# Altium project MGMEZZ02.PrjPcb (part 2 of 2)

## Sheet LvlTranslate.SchDoc: Level Translators
size Letter; Author: Adam Gilbert; CompanyName: McGill University; DrawnBy: Adam Gilbert; Organization: Altium Limited; Address1: McGill Cosmology; Address2: 3600 University Street; Address3: Montreal, Quebec; Address4: Canada; Revision: Rev0; ProjectTitle: Dan DfMux Mezz; ModelNumber: MGMEZZ04; ProjectName: Dan DfMux Mezz
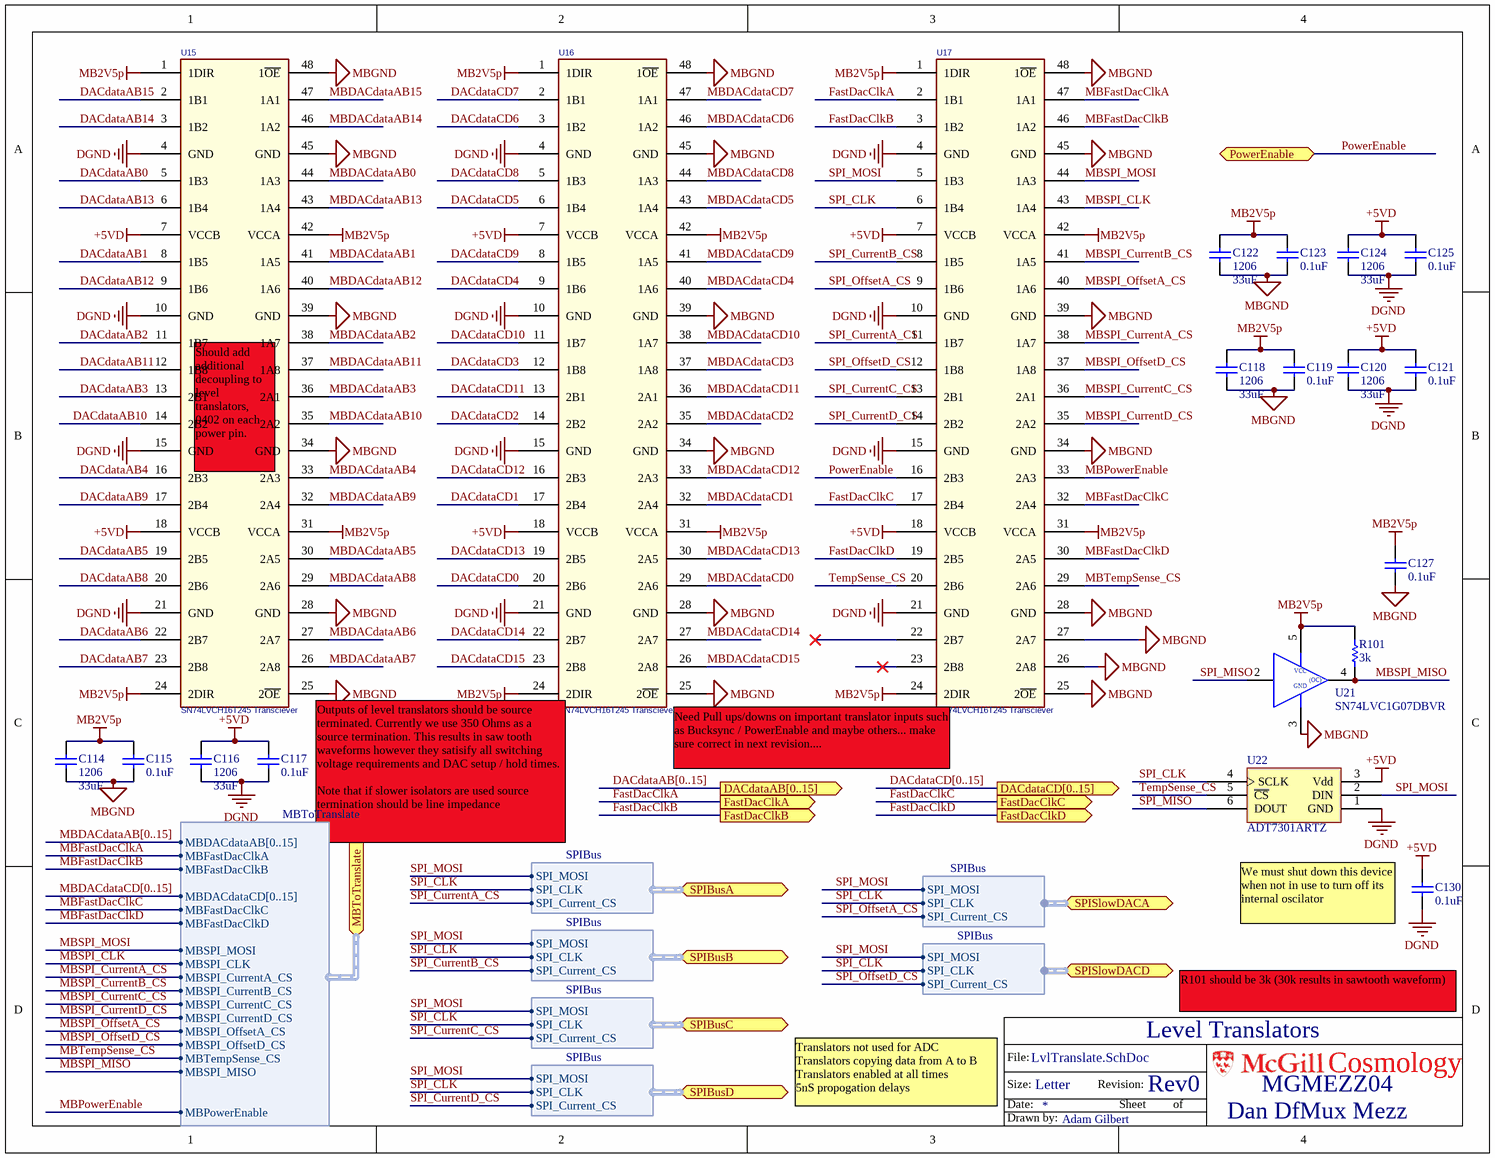
[diagram p5: LvlTranslate.SchDoc]

### Parts
C114  Footprint: 1206  [CC3225-1210]  (hidden comment: 33uF)
C115  0.1uF  [0603]
C116  Footprint: 1206  [CC3225-1210]  (hidden comment: 33uF)
C117  0.1uF  [0603]
C118  Footprint: 1206  [CC3225-1210]  (hidden comment: 33uF)
C119  0.1uF  [0603]
C120  Footprint: 1206  [CC3225-1210]  (hidden comment: 33uF)
C121  0.1uF  [0603]
C122  Footprint: 1206  [CC3225-1210]  (hidden comment: 33uF)
C123  0.1uF  [0603]
C124  Footprint: 1206  [CC3225-1210]  (hidden comment: 33uF)
C125  0.1uF  [0603]
C127  0.1uF  [0603]
C130  0.1uF  [0603]
R101  3k  [0603]
U15  SN74LVCH16T245 Transciever  [TSSOP48-0.5mmpitch]
U16  SN74LVCH16T245 Transciever  [TSSOP48-0.5mmpitch]
U17  SN74LVCH16T245 Transciever  [TSSOP48-0.5mmpitch]
U21  Manufacturers Part Number: SN74LVC1G07DBVR  [SOT23-5]  (hidden comment: 74LVC1G07)
U22  ADT7301ARTZ  [SOT23-6]

### Ports
DACdataAB[0..15] (out), DACdataCD[0..15] (out), FastDacClkA (out), FastDacClkB (out), FastDacClkC (out), FastDacClkD (out), MBToTranslate (harness MBToTranslate), PowerEnable, SPIBusA (harness SPIBus), SPIBusB (harness SPIBus), SPIBusC (harness SPIBus), SPIBusD (harness SPIBus), SPISlowDACA (harness SPIBus), SPISlowDACD (harness SPIBus)

### Harnesses
MBToTranslate: MBDACdataAB[0..15], MBFastDacClkA, MBSPI_MOSI, MBSPI_CLK, MBFastDacClkB, MBFastDacClkC, MBFastDacClkD, MBDACdataCD[0..15], MBPowerEnable, MBSPI_CurrentA_CS, MBSPI_CurrentB_CS, MBSPI_CurrentC_CS, MBSPI_CurrentD_CS, MBSPI_OffsetA_CS, MBSPI_OffsetD_CS, MBTempSense_CS, MBSPI_MISO
SPIBus: SPI_MOSI, SPI_CLK, SPI_Current_CS

### Nets
+5VD: C116.1 C117.1 C120.1 C121.1 C124.1 C125.1 C130.1 U15.7(VCCB) U15.18(VCCB) U16.7(VCCB) U16.18(VCCB) U17.7(VCCB) U17.18(VCCB) U22.3(Vdd)
DGND: C116.2 C117.2 C120.2 C121.2 C124.2 C125.2 C130.2 U15.4(GND) U15.10(GND) U15.15(GND) U15.21(GND) U16.4(GND) U16.10(GND) U16.15(GND) U16.21(GND) U17.4(GND) U17.10(GND) U17.15(GND) U17.21(GND) U22.1(GND)
MB2V5p: C114.1 C115.1 C118.1 C119.1 C122.1 C123.1 C127.1 R101.2 U15.1(1DIR) U15.24(2DIR) U15.31(VCCA) U15.42(VCCA) U16.1(1DIR) U16.24(2DIR) U16.31(VCCA) U16.42(VCCA) U17.1(1DIR) U17.24(2DIR) U17.31(VCCA) U17.42(VCCA) U21.5(Vcc)
MBGND: C114.2 C115.2 C118.2 C119.2 C122.2 C123.2 C127.2 U15.25(2~{OE}) U15.28(GND) U15.34(GND) U15.39(GND) U15.45(GND) U15.48(1~{OE}) U16.25(2~{OE}) U16.28(GND) U16.34(GND) U16.39(GND) U16.45(GND) U16.48(1~{OE}) U17.25(2~{OE}) U17.26(2A8) U17.27(2A7) U17.28(GND) U17.34(GND) U17.39(GND) U17.45(GND) U17.48(1~{OE}) U21.3(Gnd)
DACdataAB0: U15.5(1B3)
DACdataAB1: U15.8(1B5)
DACdataAB2: U15.11(1B7)
DACdataAB3: U15.13(2B1)
DACdataAB4: U15.16(2B3)
DACdataAB5: U15.19(2B5)
DACdataAB6: U15.22(2B7)
DACdataAB7: U15.23(2B8)
DACdataAB8: U15.20(2B6)
DACdataAB9: U15.17(2B4)
DACdataAB10: U15.14(2B2)
DACdataAB11: U15.12(1B8)
DACdataAB12: U15.9(1B6)
DACdataAB13: U15.6(1B4)
DACdataAB14: U15.3(1B2)
DACdataAB15: U15.2(1B1)
DACdataCD0: U16.20(2B6)
DACdataCD1: U16.17(2B4)
DACdataCD2: U16.14(2B2)
DACdataCD3: U16.12(1B8)
DACdataCD4: U16.9(1B6)
DACdataCD5: U16.6(1B4)
DACdataCD6: U16.3(1B2)
DACdataCD7: U16.2(1B1)
DACdataCD8: U16.5(1B3)
DACdataCD9: U16.8(1B5)
DACdataCD10: U16.11(1B7)
DACdataCD11: U16.13(2B1)
DACdataCD12: U16.16(2B3)
DACdataCD13: U16.19(2B5)
DACdataCD14: U16.22(2B7)
DACdataCD15: U16.23(2B8)
FastDacClkA: U17.2(1B1) ; port FastDacClkA  [project net FastDacClk]
FastDacClkB: U17.3(1B2) ; port FastDacClkB  [project net FastDacClk]
FastDacClkC: U17.17(2B4) ; port FastDacClkC  [project net FastDacClk]
FastDacClkD: U17.19(2B5) ; port FastDacClkD  [project net FastDacClk]
MBDACdataAB0: U15.44(1A3)
MBDACdataAB1: U15.41(1A5)
MBDACdataAB2: U15.38(1A7)
MBDACdataAB3: U15.36(2A1)
MBDACdataAB4: U15.33(2A3)
MBDACdataAB5: U15.30(2A5)
MBDACdataAB6: U15.27(2A7)
MBDACdataAB7: U15.26(2A8)
MBDACdataAB8: U15.29(2A6)
MBDACdataAB9: U15.32(2A4)
MBDACdataAB10: U15.35(2A2)
MBDACdataAB11: U15.37(1A8)
MBDACdataAB12: U15.40(1A6)
MBDACdataAB13: U15.43(1A4)
MBDACdataAB14: U15.46(1A2)
MBDACdataAB15: U15.47(1A1)
MBDACdataCD0: U16.29(2A6)
MBDACdataCD1: U16.32(2A4)
MBDACdataCD2: U16.35(2A2)
MBDACdataCD3: U16.37(1A8)
MBDACdataCD4: U16.40(1A6)
MBDACdataCD5: U16.43(1A4)
MBDACdataCD6: U16.46(1A2)
MBDACdataCD7: U16.47(1A1)
MBDACdataCD8: U16.44(1A3)
MBDACdataCD9: U16.41(1A5)
MBDACdataCD10: U16.38(1A7)
MBDACdataCD11: U16.36(2A1)
MBDACdataCD12: U16.33(2A3)
MBDACdataCD13: U16.30(2A5)
MBDACdataCD14: U16.27(2A7)
MBDACdataCD15: U16.26(2A8)
MBFastDacClkA: U17.47(1A1) ; port MBToTranslate.MBFastDacClkA
MBFastDacClkB: U17.46(1A2) ; port MBToTranslate.MBFastDacClkB
MBFastDacClkC: U17.32(2A4) ; port MBToTranslate.MBFastDacClkC
MBFastDacClkD: U17.30(2A5) ; port MBToTranslate.MBFastDacClkD
MBPowerEnable: U17.33(2A3) ; port MBToTranslate.MBPowerEnable
MBSPI_CLK: U17.43(1A4) ; port MBToTranslate.MBSPI_CLK
MBSPI_CurrentA_CS: U17.38(1A7) ; port MBToTranslate.MBSPI_CurrentA_CS
MBSPI_CurrentB_CS: U17.41(1A5) ; port MBToTranslate.MBSPI_CurrentB_CS
MBSPI_CurrentC_CS: U17.36(2A1) ; port MBToTranslate.MBSPI_CurrentC_CS
MBSPI_CurrentD_CS: U17.35(2A2) ; port MBToTranslate.MBSPI_CurrentD_CS
MBSPI_MISO: R101.1 U21.4(Y) ; port MBToTranslate.MBSPI_MISO
MBSPI_MOSI: U17.44(1A3) ; port MBToTranslate.MBSPI_MOSI
MBSPI_OffsetA_CS: U17.40(1A6) ; port MBToTranslate.MBSPI_OffsetA_CS
MBSPI_OffsetD_CS: U17.37(1A8) ; port MBToTranslate.MBSPI_OffsetD_CS
MBTempSense_CS: U17.29(2A6) ; port MBToTranslate.MBTempSense_CS
PowerEnable: U17.16(2B3) ; port PowerEnable
SPI_CLK: U17.6(1B4) U22.4(SCLK) ; port SPIBusA.SPI_CLK, port SPISlowDACA.SPI_CLK, port SPISlowDACD.SPI_CLK, port SPIBusB.SPI_CLK, port SPIBusC.SPI_CLK, port SPIBusD.SPI_CLK
SPI_CurrentA_CS: U17.11(1B7) ; port SPIBusA.SPI_Current_CS  [project net SPI_Current_CS]
SPI_CurrentB_CS: U17.8(1B5) ; port SPIBusB.SPI_Current_CS  [project net SPI_Current_CS]
SPI_CurrentC_CS: U17.13(2B1) ; port SPIBusC.SPI_Current_CS  [project net SPI_Current_CS]
SPI_CurrentD_CS: U17.14(2B2) ; port SPIBusD.SPI_Current_CS  [project net SPI_Current_CS]
SPI_MISO: U21.2(A) U22.6(DOUT)
SPI_MOSI: U17.5(1B3) U22.2(DIN) ; port SPIBusA.SPI_MOSI, port SPISlowDACA.SPI_MOSI, port SPISlowDACD.SPI_MOSI, port SPIBusB.SPI_MOSI, port SPIBusC.SPI_MOSI, port SPIBusD.SPI_MOSI
SPI_OffsetA_CS: U17.9(1B6) ; port SPISlowDACA.SPI_Current_CS  [project net SPI_Offset_CS]
SPI_OffsetD_CS: U17.12(1B8) ; port SPISlowDACD.SPI_Current_CS  [project net SPI_Offset_CS]
TempSense_CS: U17.20(2B6) U22.5(~{CS})

Not connected (* = marked no-connect by the designer): U17 22(2B7)* 23(2B8)*

### Buses and harness runs
bus DACdataAB[0..15] = port DACdataAB[0..15]
bus DACdataCD[0..15] = port DACdataCD[0..15]
bus MBDACdataAB[0..15]
bus MBDACdataCD[0..15]

### Notes on the sheet
- (near U15) Should add additional decoupling to level translators, 0402 on each power pin.
- Need Pull ups/downs on important translator inputs such as Bucksync / PowerEnable and maybe others... make sure correct in next revision....
- (near U16) Outputs of level translators should be source terminated. Currently we use 350 Ohms as a source termination. This results in saw tooth waveforms however they satisify all switching voltage requirements and DAC setup / hold times.
  Note that if slower isolators are used source termination should be line impedance
- (near C130) We must shut down this device when not in use to turn off its internal oscilator
- R101 should be 3k (30k results in sawtooth waveform)
- Translators not used for ADC
  Translators copying data from A to B
  Translators enabled at all times
  5nS propogation delays
- File:
- Size:
- Date:
- Letter
- Revision:
- Sheet
- of
- Cosmology
- Drawn by:
- (in symbol 74LVC1G07) VCC; (OC); GND

### Library data of the parts
C114 C116 C118 C120 C122 C124 = CAP 1210: Capacitor, Ceramic, 1210; Manufacturer: TDK Corporation; Part Constraints: 33uF or 47uF  (1206 or 1210) 25V X5R; Manufacturers Part Number: C3216X5R1E336M; Assembly Comments: none; Type: Capacitor; SupplierUnitCost: $1.1; Value: 33uF; Supplier 1: Digi-Key; Supplier Part Number 1: 445-8046-1-ND
C115 C117 C119 C121 C123 C125 C127 C130 = CAP 0603: Capacitor, Ceramic, 0603; Part Constraints: 10% 16V X7R 0603; Manufacturer: Generic; Manufacturers Part Number: Generic; Value: 0.1uF; Type: Capacitor; SupplierUnitCost: 0
R101 = RES 0603: Resistor; Manufacturer: Generic; Part Constraints: 1% 1/10W 100ppm 0603; Assembly Comments: none; Manufacturers Part Number: Generic; Type: Resistor; SupplierUnitCost: 0; Value: 3k
U15-U17 = SN74LVCH16T245 Transciever: Manufacturer: Texas Instruments; Assembly Comments: none; Part Constraints: SN74LVCH16T245; Manufacturers Part Number: SN74LVCH16T245; Type: IC; Supplier 1: Digi-Key; Supplier Part Number 1: 296-27606-6-ND
U21 = 74LVC1G07: Single  NON-INVERTING BUFFER, Open Drain; Manufacturer: Texas Instruments; Assembly Comments: none; Part Constraints: SN74LVC1G07DBVR; SupplierUnitCost: $0.09; Type: IC; Supplier 1: Digi-Key; Supplier Part Number 1: 296-8485-1-ND
U22 = ADT7301: Digital Temperature Sensor, 13-Bit, +/-1 Degree Accurate; Manufacturer: Analog Devices; CanPurchaseFrom: Digikey; Footprint: *; TechInfo: *; Manufacturers Part Number: ADT7301ARTZ; Part constraints: ADT7301ARTZ

## Sheet SlowDAC.SchDoc: Slow DAC
size Letter
Used 2 times, as channels AF, DF. Parts and nets are listed once, with the designators drawn on the sheet.
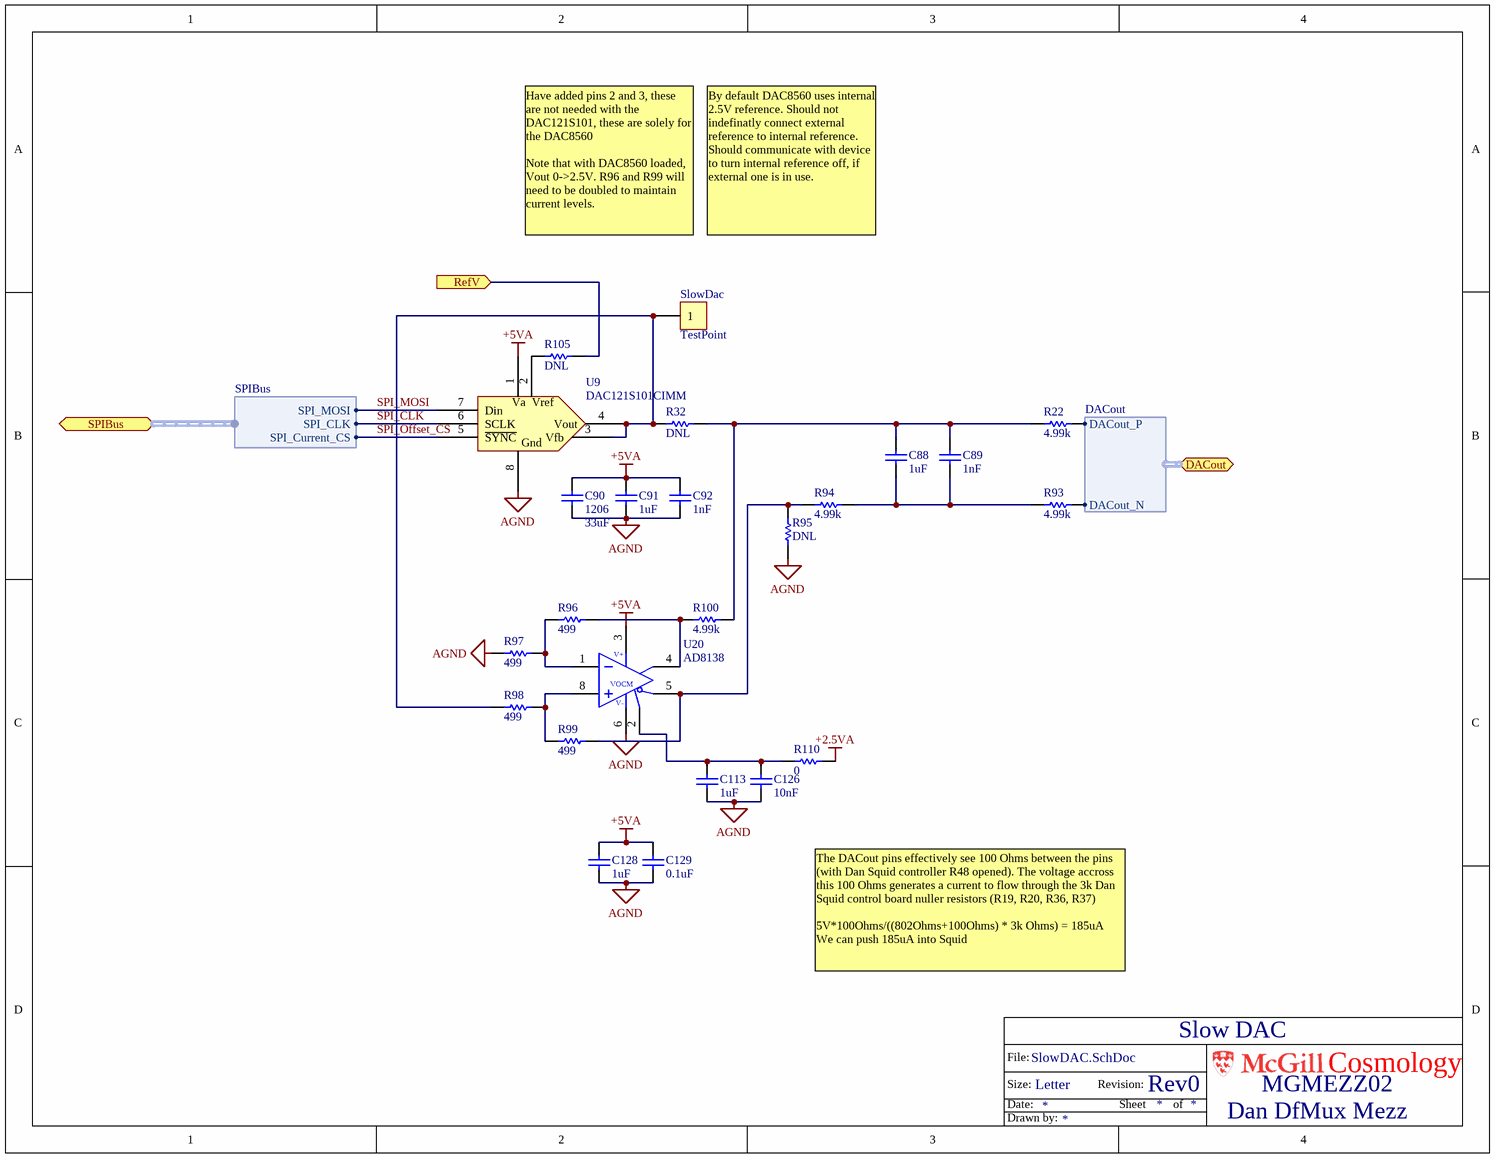
[diagram p6: SlowDAC.SchDoc]

### Parts
C88  1uF  [0603]
C89  1nF  [0603]
C90  Footprint: 1206  [CC3225-1210]  (hidden comment: 33uF)
C91  1uF  [0603]
C92  1nF  [0603]
C113  1uF  [0603]
C126  10nF  [0603]
C128  1uF  [0603]
C129  0.1uF  [0603]
R22  4.99k  [0603]
R32  DNL  [0603]
R93  4.99k  [0603]
R94  4.99k  [0603]
R95  DNL  [0603]
R96  499  [0603]
R97  499  [0603]
R98  499  [0603]
R99  499  [0603]
R100  4.99k  [0603]
R105  DNL  [0603]
R110  0  [0603]
SlowDac  TestPoint  [TP-3520-SK]  (no BOM)
U9  DAC121S101CIMM  [MSOP-8]
U20  AD8138  [SO8]

### Ports
DACout (harness DACout), RefV (in), SPIBus (harness SPIBus)

### Harnesses
DACout: DACout_N, DACout_P
SPIBus: SPI_MOSI, SPI_CLK, SPI_Current_CS

### Nets
+2.5VA: R110.1
+5VA: C90.2 C91.2 C92.2 C128.2 C129.1 U9.1(Va) U20.3(V+)
AGND: C90.1 C91.1 C92.1 C113.1 C126.1 C128.1 C129.2 R95.2 R97.2 U9.8(Gnd) U20.6(V-)
RefV: R105.2 ; port RefV
SPI_CLK: U9.6(SCLK) ; port SPIBus.SPI_CLK
SPI_MOSI: U9.7(Din) ; port SPIBus.SPI_MOSI
SPI_Offset_CS: U9.5(~{SYNC}) ; port SPIBus.SPI_Current_CS
NetC88_1: C88.1 C89.1 R93.2 R94.1
NetC88_2: C88.2 C89.2 R22.2 R32.1 R100.1
NetC113_2: C113.2 C126.2 R110.2 U20.2(VOCM)
NetR22_1: R22.1 ; port DACout.DACout_P
NetR32_2: R32.2 R98.2 SlowDac.1 U9.3(NC) U9.4(Vout)
NetR93_1: R93.1 ; port DACout.DACout_N
NetR94_2: R94.2 R95.1 R99.1 U20.5(OUT-)
NetR96_1: R96.1 R100.2 U20.4(OUT+)
NetR96_2: R96.2 R97.1 U20.1(IN-)
NetR98_1: R98.1 R99.2 U20.8(IN+)
NetR105_1: R105.1 U9.2(NC)

Not connected (* = marked no-connect by the designer): U20 7(NC)

### Channels
AF: designators end in AF; ports RefV=RefVolt
DF: designators end in DF; ports RefV=RefVolt

### Notes on the sheet
- Have added pins 2 and 3, these are not needed with the DAC121S101, these are solely for the DAC8560
  Note that with DAC8560 loaded, Vout 0->2.5V. R96 and R99 will need to be doubled to maintain current levels.
- By default DAC8560 uses internal 2.5V reference. Should not indefinatly connect external reference to internal reference. Should communicate with device to turn internal reference off, if external one is in use.
- The DACout pins effectively see 100 Ohms between the pins (with Dan Squid controller R48 opened). The voltage accross this 100 Ohms generates a current to flow through the 3k Dan Squid control board nuller resistors (R19, R20, R36, R37)
  5V*100Ohms/((802Ohms+100Ohms) * 3k Ohms) = 185uA
  We can push 185uA into Squid
- File:
- Size:
- Date:
- Letter
- Revision:
- Sheet
- of
- Cosmology
- Drawn by:

### Library data of the parts
C88 C91 = CAP 0603: Capacitor, Ceramic, 0603; Part Constraints: 10% 16V X7R 0603; Manufacturer: Generic; Manufacturers Part Number: e.g C1608X7R1C105K; Value: 1uF; Type: Capacitor; SupplierUnitCost: $0.12
C89 C92 C129 = CAP 0603: as C115 on sheet LvlTranslate; Manufacturers Part Number: Generic; Type: Capacitor; SupplierUnitCost: 0
  C89 C92: Value: 1nF
  C129: Value: 0.1uF
C90 = CAP 1210: as C114 on sheet LvlTranslate; Type: Capacitor; SupplierUnitCost: $1.1; Value: 33uF; Supplier 1: Digi-Key; Supplier Part Number 1: 445-8046-1-ND
C113 C128 = CAP 0603: Capacitor, Ceramic, 0603; Part Constraints: 10% 16V X7R 0603; Manufacturer: Generic; Manufacturers Part Number: e.g C1608X7R1C105K; Assembly Comments: none; Value: 1uF; Type: Capacitor; SupplierUnitCost: $0.12
C126 = CAP 0603: Capacitor, Ceramic, 0603; Part Constraints: 10% 16V X7R 0603; Manufacturer: Generic; Assembly Comments: none; Manufacturers Part Number: Generic; Value: 10nF; Type: Capacitor; SupplierUnitCost: 0
R22 R32 R93-R100 R105 R110 = RES 0603: as R1 on sheet ADC; Manufacturers Part Number: Generic; Type: Resistor; SupplierUnitCost: 0
  R22 R93 R94 R100: Value: 4.99k
  R32 R95 R105: Value: DNL
  R96-R99: Value: 499
  R110: Value: 0
SlowDac = TestPoint: TestPoint1; Assembly Comments: none; Footprint: *; Type: Test Point; SupplierUnitCost: 0
U9 = DAC121S101CIMM/NOPB: CONV D/A 12BIT MICROPWR 8MSOP; Manufacturer: National Semiconductor; Settling Time: 12µs; Number of Bits: 12; Data Interface: DSP, MICROWIRE™, QSPI™, Serial, SPI™; Number of Converters: 1; Voltage Supply Source: Single Supply; Power Dissipation (Max): 1.72mW; Number of Outputs and Type: 1 Voltage, Unipolar; 1 Voltage, Bipolar; Assembly Comments: none; RoHS: RoHS Compliant; Category: Integrated Circuits (ICs); Stock 1: 3011; Pricing 1: 1=3.5, 25=2.8616, 100=2.5698, 250=2.33624, 500=2.0442 (CAD); Operating Temperature: -40°C ~ 105°C; Mounting Type: Surface Mount; Package / Case: 8-TSSOP, 8-MSOP (0.118", 3.00mm Width); Supplier Device Package: 8-MSOP; Packaging: Cut Tape (CT); Sampling Rate (Per Second): *; ComponentLink1URL: http://www.ti.com/lit/ds/symlink/dac121s101.pdf; ComponentLink1Description: http://www.ti.com/lit/ds/symlink/dac121s101.pdf; Supplier 1: Digi-Key; Supplier Part Number 1: DAC121S101CIMMCT-ND; Part Constraints: DAC121S101CIMM/NOPB; Manufacturers Part Number: DAC121S101CIMM/NOPB; Type: IC; SupplierUnitCost: $3.70
U20 = AD8138: IC AMP DIFF LDIST LP 95MA 8SOIC; Manufacturer: Analog Devices Inc; Manufacturers Part Number: AD8138ARZ; Assembly Comments: none; Supplier 1: Digi-Key; RoHS: RoHS Compliant; Category: Integrated Circuits (ICs); Type: IC; Applications: Data Acquisition; Mounting Type: Surface Mount; Package / Case: 8-SOIC (0.154", 3.90mm Width); Supplier Device Package: 8-SOIC; Packaging: Tube; ComponentLink1URL: http://www.analog.com/static/imported-files/data_sheets/AD8138.pdf; ComponentLink1Description: http://www.analog.com/static/imported-files/data_sheets/AD8138.pdf; Part Constraints: AD8138ARZ; SupplierUnitCost: $6.44

## Sheet FMCLPCConnector.SchDoc: FMC Connector
size Letter; ProjectTitle: Dan DfMux Mezz; ModelNumber: MGMEZZ04
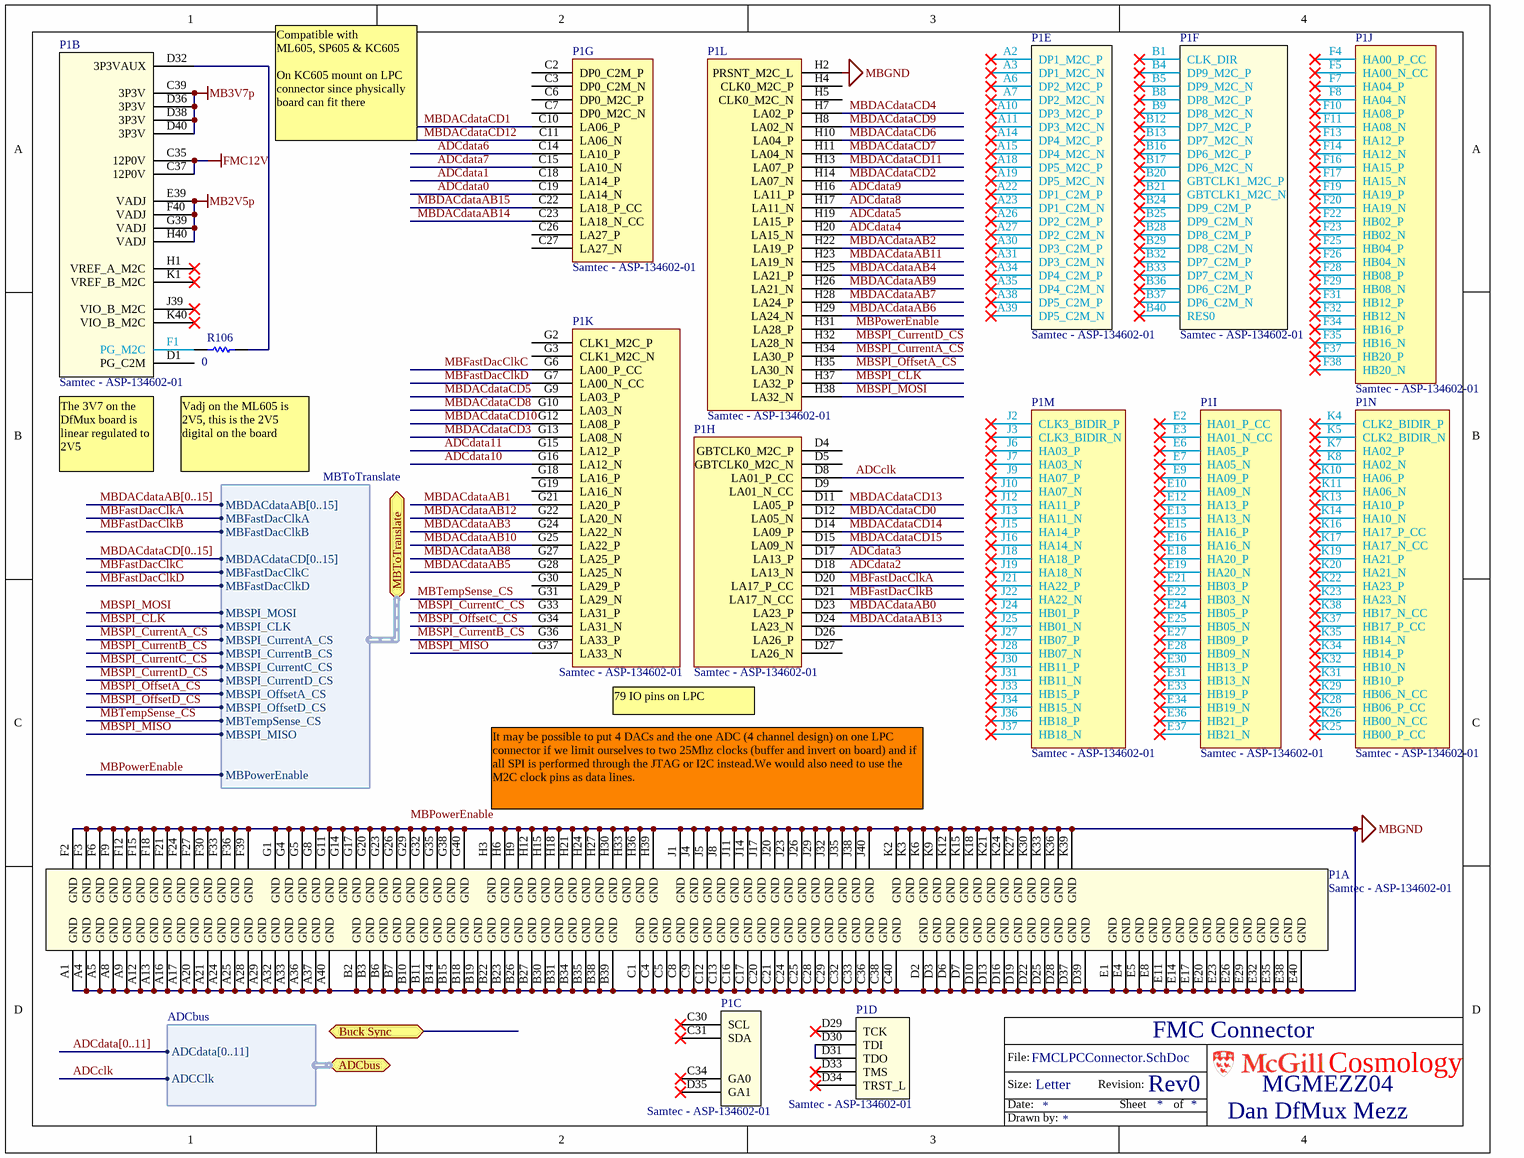
[diagram p7: FMCLPCConnector.SchDoc]

### Parts
P1  Samtec - ASP-134602-01  [BTB-SM1-27-2V400M]  (parts A,B,C,D,E,F,G,H,I,J,K,L,M,N of 14)
R106  0  [0603]

### Ports
ADCbus (harness ADCbus), Buck Sync, MBToTranslate (harness MBToTranslate)

### Harnesses
ADCbus: ADCdata[0..11], ADCClk
MBToTranslate: MBDACdataAB[0..15], MBFastDacClkA, MBSPI_MOSI, MBSPI_CLK, MBFastDacClkB, MBFastDacClkC, MBFastDacClkD, MBDACdataCD[0..15], MBPowerEnable, MBSPI_CurrentA_CS, MBSPI_CurrentB_CS, MBSPI_CurrentC_CS, MBSPI_CurrentD_CS, MBSPI_OffsetA_CS, MBSPI_OffsetD_CS, MBTempSense_CS, MBSPI_MISO

### Nets
FMC12V: P1.C35(12P0V) P1.C37(12P0V)
MB2V5p: P1.E39(VADJ) P1.F40(VADJ) P1.G39(VADJ) P1.H40(VADJ)
MB3V7p: P1.C39(3P3V) P1.D36(3P3V) P1.D38(3P3V) P1.D40(3P3V)
MBGND: P1.A1(GND) P1.A4(GND) P1.A5(GND) P1.A8(GND) P1.A9(GND) P1.A12(GND) P1.A13(GND) P1.A16(GND) P1.A17(GND) P1.A20(GND) P1.A21(GND) P1.A24(GND) P1.A25(GND) P1.A28(GND) P1.A29(GND) P1.A32(GND) P1.A33(GND) P1.A36(GND) P1.A37(GND) P1.A40(GND) P1.B2(GND) P1.B3(GND) P1.B6(GND) P1.B7(GND) P1.B10(GND) P1.B11(GND) P1.B14(GND) P1.B15(GND) P1.B18(GND) P1.B19(GND) P1.B22(GND) P1.B23(GND) P1.B26(GND) P1.B27(GND) P1.B30(GND) P1.B31(GND) P1.B34(GND) P1.B35(GND) P1.B38(GND) P1.B39(GND) P1.C1(GND) P1.C4(GND) P1.C5(GND) P1.C8(GND) P1.C9(GND) P1.C12(GND) P1.C13(GND) P1.C16(GND) P1.C17(GND) P1.C20(GND) P1.C21(GND) P1.C24(GND) P1.C25(GND) P1.C28(GND) P1.C29(GND) P1.C32(GND) P1.C33(GND) P1.C36(GND) P1.C38(GND) P1.C40(GND) P1.D2(GND) P1.D3(GND) P1.D6(GND) P1.D7(GND) P1.D10(GND) P1.D13(GND) P1.D16(GND) P1.D19(GND) P1.D22(GND) P1.D25(GND) P1.D28(GND) P1.D37(GND) P1.D39(GND) P1.E1(GND) P1.E4(GND) P1.E5(GND) P1.E8(GND) P1.E11(GND) P1.E14(GND) P1.E17(GND) P1.E20(GND) P1.E23(GND) P1.E26(GND) P1.E29(GND) P1.E32(GND) P1.E35(GND) P1.E38(GND) P1.E40(GND) P1.F2(GND) P1.F3(GND) P1.F6(GND) P1.F9(GND) P1.F12(GND) P1.F15(GND) P1.F18(GND) P1.F21(GND) P1.F24(GND) P1.F27(GND) P1.F30(GND) P1.F33(GND) P1.F36(GND) P1.F39(GND) P1.G1(GND) P1.G4(GND) P1.G5(GND) P1.G8(GND) P1.G11(GND) P1.G14(GND) P1.G17(GND) P1.G20(GND) P1.G23(GND) P1.G26(GND) P1.G29(GND) P1.G32(GND) P1.G35(GND) P1.G38(GND) P1.G40(GND) P1.H2(PRSNT_M2C_L) P1.H3(GND) P1.H6(GND) P1.H9(GND) P1.H12(GND) P1.H15(GND) P1.H18(GND) P1.H21(GND) P1.H24(GND) P1.H27(GND) P1.H30(GND) P1.H33(GND) P1.H36(GND) P1.H39(GND) P1.J1(GND) P1.J4(GND) P1.J5(GND) P1.J8(GND) P1.J11(GND) P1.J14(GND) P1.J17(GND) P1.J20(GND) P1.J23(GND) P1.J26(GND) P1.J29(GND) P1.J32(GND) P1.J35(GND) P1.J38(GND) P1.J40(GND) P1.K2(GND) P1.K3(GND) P1.K6(GND) P1.K9(GND) P1.K12(GND) P1.K15(GND) P1.K18(GND) P1.K21(GND) P1.K24(GND) P1.K27(GND) P1.K30(GND) P1.K33(GND) P1.K36(GND) P1.K39(GND)
ADCclk: P1.D8(LA01_P_CC) ; port ADCbus.ADCClk
ADCdata0: P1.C19(LA14_N)
ADCdata1: P1.C18(LA14_P)
ADCdata2: P1.D18(LA13_N)
ADCdata3: P1.D17(LA13_P)
ADCdata4: P1.H20(LA15_N)
ADCdata5: P1.H19(LA15_P)
ADCdata6: P1.C14(LA10_P)
ADCdata7: P1.C15(LA10_N)
ADCdata8: P1.H17(LA11_N)
ADCdata9: P1.H16(LA11_P)
ADCdata10: P1.G16(LA12_N)
ADCdata11: P1.G15(LA12_P)
MBDACdataAB0: P1.D23(LA23_P)
MBDACdataAB1: P1.G21(LA20_P)
MBDACdataAB2: P1.H22(LA19_P)
MBDACdataAB3: P1.G24(LA22_N)
MBDACdataAB4: P1.H25(LA21_P)
MBDACdataAB5: P1.G28(LA25_N)
MBDACdataAB6: P1.H29(LA24_N)
MBDACdataAB7: P1.H28(LA24_P)
MBDACdataAB8: P1.G27(LA25_P)
MBDACdataAB9: P1.H26(LA21_N)
MBDACdataAB10: P1.G25(LA22_P)
MBDACdataAB11: P1.H23(LA19_N)
MBDACdataAB12: P1.G22(LA20_N)
MBDACdataAB13: P1.D24(LA23_N)
MBDACdataAB14: P1.C23(LA18_N_CC)
MBDACdataAB15: P1.C22(LA18_P_CC)
MBDACdataCD0: P1.D12(LA05_N)
MBDACdataCD1: P1.C10(LA06_P)
MBDACdataCD2: P1.H14(LA07_N)
MBDACdataCD3: P1.G13(LA08_N)
MBDACdataCD4: P1.H7(LA02_P)
MBDACdataCD5: P1.G9(LA03_P)
MBDACdataCD6: P1.H10(LA04_P)
MBDACdataCD7: P1.H11(LA04_N)
MBDACdataCD8: P1.G10(LA03_N)
MBDACdataCD9: P1.H8(LA02_N)
MBDACdataCD10: P1.G12(LA08_P)
MBDACdataCD11: P1.H13(LA07_P)
MBDACdataCD12: P1.C11(LA06_N)
MBDACdataCD13: P1.D11(LA05_P)
MBDACdataCD14: P1.D14(LA09_P)
MBDACdataCD15: P1.D15(LA09_N)
MBFastDacClkA: P1.D20(LA17_P_CC) ; port MBToTranslate.MBFastDacClkA
MBFastDacClkB: P1.D21(LA17_N_CC) ; port MBToTranslate.MBFastDacClkB
MBFastDacClkC: P1.G6(LA00_P_CC) ; port MBToTranslate.MBFastDacClkC
MBFastDacClkD: P1.G7(LA00_N_CC) ; port MBToTranslate.MBFastDacClkD
MBPowerEnable: P1.H31(LA28_P) ; port MBToTranslate.MBPowerEnable
MBSPI_CLK: P1.H37(LA32_P) ; port MBToTranslate.MBSPI_CLK
MBSPI_CurrentA_CS: P1.H34(LA30_P) ; port MBToTranslate.MBSPI_CurrentA_CS
MBSPI_CurrentB_CS: P1.G36(LA33_P) ; port MBToTranslate.MBSPI_CurrentB_CS
MBSPI_CurrentC_CS: P1.G33(LA31_P) ; port MBToTranslate.MBSPI_CurrentC_CS
MBSPI_CurrentD_CS: P1.H32(LA28_N) ; port MBToTranslate.MBSPI_CurrentD_CS
MBSPI_MISO: P1.G37(LA33_N) ; port MBToTranslate.MBSPI_MISO
MBSPI_MOSI: P1.H38(LA32_N) ; port MBToTranslate.MBSPI_MOSI
MBSPI_OffsetA_CS: P1.H35(LA30_N) ; port MBToTranslate.MBSPI_OffsetA_CS
MBSPI_OffsetC_CS: P1.G34(LA31_N)
MBTempSense_CS: P1.G31(LA29_N) ; port MBToTranslate.MBTempSense_CS
NetP1_D30: P1.D30(TDI) P1.D31(TDO)
NetP1_D32: P1.D32(3P3VAUX) R106.1
NetP1_F1: P1.F1(PG_M2C) R106.2

Not connected (* = marked no-connect by the designer): P1 A2(DP1_M2C_P)* A3(DP1_M2C_N)* A6(DP2_M2C_P)* A7(DP2_M2C_N)* A10(DP3_M2C_P)* A11(DP3_M2C_N)* A14(DP4_M2C_P)* A15(DP4_M2C_N)* A18(DP5_M2C_P)* A19(DP5_M2C_N)* A22(DP1_C2M_P)* A23(DP1_C2M_N)* A26(DP2_C2M_P)* A27(DP2_C2M_N)* A30(DP3_C2M_P)* A31(DP3_C2M_N)* A34(DP4_C2M_P)* A35(DP4_C2M_N)* A38(DP5_C2M_P)* A39(DP5_C2M_N)* B1(CLK_DIR)* B4(DP9_M2C_P)* B5(DP9_M2C_N)* B8(DP8_M2C_P)* B9(DP8_M2C_N)* B12(DP7_M2C_P)* B13(DP7_M2C_N)* B16(DP6_M2C_P)* B17(DP6_M2C_N)* B20(GBTCLK1_M2C_P)* B21(GBTCLK1_M2C_N)* B24(DP9_C2M_P)* B25(DP9_C2M_N)* B28(DP8_C2M_P)* B29(DP8_C2M_N)* B32(DP7_C2M_P)* B33(DP7_C2M_N)* B36(DP6_C2M_P)* B37(DP6_C2M_N)* B40(RES0)* C2(DP0_C2M_P) C3(DP0_C2M_N) C6(DP0_M2C_P) C7(DP0_M2C_N) C26(LA27_P) C27(LA27_N) C30(SCL)* C31(SDA)* C34(GA0)* D1(PG_C2M) D4(GBTCLK0_M2C_P) D5(GBTCLK0_M2C_N) D9(LA01_N_CC) D26(LA26_P) D27(LA26_N) D29(TCK)* D33(TMS)* D34(TRST_L)* D35(GA1)* E2(HA01_P_CC)* E3(HA01_N_CC)* E6(HA05_P)* E7(HA05_N)* E9(HA09_P)* E10(HA09_N)* E12(HA13_P)* E13(HA13_N)* E15(HA16_P)* E16(HA16_N)* E18(HA20_P)* E19(HA20_N)* E21(HB03_P)* E22(HB03_N)* E24(HB05_P)* E25(HB05_N)* E27(HB09_P)* E28(HB09_N)* E30(HB13_P)* E31(HB13_N)* E33(HB19_P)* E34(HB19_N)* E36(HB21_P)* E37(HB21_N)* F4(HA00_P_CC)* F5(HA00_N_CC)* F7(HA04_P)* F8(HA04_N)* F10(HA08_P)* F11(HA08_N)* F13(HA12_P)* F14(HA12_N)* F16(HA15_P)* F17(HA15_N)* F19(HA19_P)* F20(HA19_N)* F22(HB02_P)* F23(HB02_N)* F25(HB04_P)* F26(HB04_N)* F28(HB08_P)* F29(HB08_N)* F31(HB12_P)* F32(HB12_N)* F34(HB16_P)* F35(HB16_N)* F37(HB20_P)* F38(HB20_N)* G2(CLK1_M2C_P) G3(CLK1_M2C_N) G18(LA16_P) G19(LA16_N) G30(LA29_P) H1(VREF_A_M2C)* H4(CLK0_M2C_P) H5(CLK0_M2C_N) J2(CLK3_BIDIR_P)* J3(CLK3_BIDIR_N)* J6(HA03_P)* J7(HA03_N)* J9(HA07_P)* J10(HA07_N)* J12(HA11_P)* J13(HA11_N)* J15(HA14_P)* J16(HA14_N)* J18(HA18_P)* J19(HA18_N)* J21(HA22_P)* J22(HA22_N)* J24(HB01_P)* J25(HB01_N)* J27(HB07_P)* J28(HB07_N)* J30(HB11_P)* J31(HB11_N)* J33(HB15_P)* J34(HB15_N)* J36(HB18_P)* J37(HB18_N)* J39(VIO_B_M2C)* K1(VREF_B_M2C)* K4(CLK2_BIDIR_P)* K5(CLK2_BIDIR_N)* K7(HA02_P)* K8(HA02_N)* K10(HA06_P)* K11(HA06_N)* K13(HA10_P)* K14(HA10_N)* K16(HA17_P_CC)* K17(HA17_N_CC)* K19(HA21_P)* K20(HA21_N)* K22(HA23_P)* K23(HA23_N)* K25(HB00_P_CC)* K26(HB00_N_CC)* K28(HB06_P_CC)* K29(HB06_N_CC)* K31(HB10_P)* K32(HB10_N)* K34(HB14_P)* K35(HB14_N)* K37(HB17_P_CC)* K38(HB17_N_CC)* K40(VIO_B_M2C)*

### Buses and harness runs
bus ADCdata[0..11]
bus MBDACdataAB[0..15]
bus MBDACdataCD[0..15]

### Notes on the sheet
- Compatible with
  ML605, SP605 & KC605
  On KC605 mount on LPC connector since physically board can fit there
- (near P1) The 3V7 on the DfMux board is linear regulated to 2V5
- Vadj on the ML605 is 2V5, this is the 2V5 digital on the board
- (near P1) 79 IO pins on LPC
- It may be possible to put 4 DACs and the one ADC (4 channel design) on one LPC connector if we limit ourselves to two 25Mhz clocks (buffer and invert on board) and if all SPI is performed through the JTAG or I2C instead.We would also need to use the M2C clock pins as data lines.
- Labels drawn without touching a wire or pin: MBPowerEnable
- File:
- Size:
- Date:
- Letter
- Revision:
- Sheet
- of
- Cosmology
- Drawn by:

### Library data of the parts
P1 = Samtec - ASP-134602-01: Samtec ASP-134602-01
R106 = RES 0603: Resistor; Manufacturer: Generic; Part Constraints: 1% 1/10W 100ppm 0603; Manufacturers Part Number: Generic; Value: 0; Type: Resistor; SupplierUnitCost: 0

## Nets that join several sheets
+2.5VA: ADC (14 pins), Power (5 pins), AF (R110AF.1), DF (R110DF.1)
+2.5VD: ADC (8 pins), Power (+2.5VD.1 C108.1 L13.1 R71.2)
+5VA: ADC (8 pins), Power (5 pins), A (12 pins), AF (7 pins), DF (7 pins), B (12 pins), C (12 pins), D (12 pins)
+5VD: Power (5 pins), LvlTranslate (14 pins)
-5VA: ADC (8 pins), Power (-5VA.1 C102.2 R39.1 U13.3), A (7 pins), B (7 pins), C (7 pins), D (7 pins)
AGND: MGMEZZ02 (25 pins), ADC (42 pins), Power (14 pins), A (36 pins), AF (11 pins), DF (11 pins), B (36 pins), C (36 pins), D (36 pins)
DGND: MGMEZZ02 (J7.1), ADC (9 pins), Power (8 pins), A (R108A.1 U5A.15), LvlTranslate (20 pins), B (R108B.1 U5B.15), C (R108C.1 U5C.15), D (R108D.1 U5D.15)
FMC12V: Power (10 pins), FMCLPCConnector (P1.C35 P1.C37)
MB2V5p: ADC (8 pins), Power (C107.1 DP2.1 R46.1), Connector (J1.1 J1.2 J3.1 J3.2), LvlTranslate (21 pins), FMCLPCConnector (P1.E39 P1.F40 P1.G39 P1.H40)
MB3V7p: Power (C104.1 Ip3V7p.1 R45.1), Connector (J1.79 J1.80 J1.81 J1.82), FMCLPCConnector (P1.C39 P1.D36 P1.D38 P1.D40)
MB5V5n: Power (R79.1), Connector (J1.83 J1.84)
MB5V5p: Power (R78.1), Connector (J1.77 J1.78)
MBGND: MGMEZZ02 (J5.1), ADC (7 pins), Power (26 pins), Connector (12 pins), LvlTranslate (28 pins), FMCLPCConnector (160 pins)
ADCA_N: MGMEZZ02 (J2.11), ADC (R3.2 R4.2)
ADCA_P: MGMEZZ02 (J2.3), ADC (R4.1 R6.2)
ADCB_N: MGMEZZ02 (J2.13), ADC (R11.2 R12.2)
ADCB_P: MGMEZZ02 (J2.6), ADC (R12.1 R15.2)
ADCclk: ADC (R47.1 R107.2 U2.20), Connector (J1.19), FMCLPCConnector (P1.D8)
ADCdata0: ADC (U2.38), Connector (J1.3), FMCLPCConnector (P1.C19)
ADCdata1: ADC (U2.37), Connector (J1.4), FMCLPCConnector (P1.C18)
ADCdata2: ADC (U2.36), Connector (J1.5), FMCLPCConnector (P1.D18)
ADCdata3: ADC (U2.35), Connector (J1.6), FMCLPCConnector (P1.D17)
ADCdata4: ADC (U2.34), Connector (J1.7), FMCLPCConnector (P1.H20)
ADCdata5: ADC (U2.33), Connector (J1.8), FMCLPCConnector (P1.H19)
ADCdata6: ADC (U2.32), Connector (J1.9), FMCLPCConnector (P1.C14)
ADCdata7: ADC (U2.31), Connector (J1.10), FMCLPCConnector (P1.C15)
ADCdata8: ADC (U2.30), Connector (J1.11), FMCLPCConnector (P1.H17)
ADCdata9: ADC (U2.29), Connector (J1.12), FMCLPCConnector (P1.H16)
ADCdata10: ADC (U2.28), Connector (J1.13), FMCLPCConnector (P1.G16)
ADCdata11: ADC (U2.27), Connector (J1.14), FMCLPCConnector (P1.G15)
BuckSync: Power (BuckSync.1 U10.17 U18.4), Connector (J3.50)
DACA_N: MGMEZZ02 (J2.9), A (C112A.2 L19A.2), AF (R93AF.1)
DACA_P: MGMEZZ02 (J2.1), A (C112A.1 L18A.2), AF (R22AF.1)
DACB_N: MGMEZZ02 (J2.10), B (C112B.2 L19B.2)
DACB_P: MGMEZZ02 (J2.2), B (C112B.1 L18B.2)
DACC_N: MGMEZZ02 (J2.14), C (C112C.2 L19C.2)
DACC_P: MGMEZZ02 (J2.7), C (C112C.1 L18C.2)
DACD_N: MGMEZZ02 (J2.15), DF (R93DF.1), D (C112D.2 L19D.2)
DACD_P: MGMEZZ02 (J2.8), DF (R22DF.1), D (C112D.1 L18D.2)
DACdataAB0: A (U5A.7), LvlTranslate (U15.5), B (U5B.7)
DACdataAB1: A (U5A.8), LvlTranslate (U15.8), B (U5B.8)
DACdataAB2: A (U5A.9), LvlTranslate (U15.11), B (U5B.9)
DACdataAB3: A (U5A.10), LvlTranslate (U15.13), B (U5B.10)
DACdataAB4: A (U5A.11), LvlTranslate (U15.16), B (U5B.11)
DACdataAB5: A (U5A.12), LvlTranslate (U15.19), B (U5B.12)
DACdataAB6: A (U5A.13), LvlTranslate (U15.22), B (U5B.13)
DACdataAB7: A (U5A.14), LvlTranslate (U15.23), B (U5B.14)
DACdataAB8: A (U5A.17), LvlTranslate (U15.20), B (U5B.17)
DACdataAB9: A (U5A.18), LvlTranslate (U15.17), B (U5B.18)
DACdataAB10: A (U5A.19), LvlTranslate (U15.14), B (U5B.19)
DACdataAB11: A (U5A.20), LvlTranslate (U15.12), B (U5B.20)
DACdataAB12: A (U5A.21), LvlTranslate (U15.9), B (U5B.21)
DACdataAB13: A (U5A.22), LvlTranslate (U15.6), B (U5B.22)
DACdataAB14: A (U5A.23), LvlTranslate (U15.3), B (U5B.23)
DACdataAB15: A (U5A.24), LvlTranslate (U15.2), B (U5B.24)
DACdataCD0: LvlTranslate (U16.20), C (U5C.7), D (U5D.7)
DACdataCD1: LvlTranslate (U16.17), C (U5C.8), D (U5D.8)
DACdataCD2: LvlTranslate (U16.14), C (U5C.9), D (U5D.9)
DACdataCD3: LvlTranslate (U16.12), C (U5C.10), D (U5D.10)
DACdataCD4: LvlTranslate (U16.9), C (U5C.11), D (U5D.11)
DACdataCD5: LvlTranslate (U16.6), C (U5C.12), D (U5D.12)
DACdataCD6: LvlTranslate (U16.3), C (U5C.13), D (U5D.13)
DACdataCD7: LvlTranslate (U16.2), C (U5C.14), D (U5D.14)
DACdataCD8: LvlTranslate (U16.5), C (U5C.17), D (U5D.17)
DACdataCD9: LvlTranslate (U16.8), C (U5C.18), D (U5D.18)
DACdataCD10: LvlTranslate (U16.11), C (U5C.19), D (U5D.19)
DACdataCD11: LvlTranslate (U16.13), C (U5C.20), D (U5D.20)
DACdataCD12: LvlTranslate (U16.16), C (U5C.21), D (U5D.21)
DACdataCD13: LvlTranslate (U16.19), C (U5C.22), D (U5D.22)
DACdataCD14: LvlTranslate (U16.22), C (U5C.23), D (U5D.23)
DACdataCD15: LvlTranslate (U16.23), C (U5C.24), D (U5D.24)
FastDacClk: A (R108A.2 U5A.16), LvlTranslate (U17.2)
FastDacClk: LvlTranslate (U17.3), B (R108B.2 U5B.16)
FastDacClk: LvlTranslate (U17.17), C (R108C.2 U5C.16)
FastDacClk: LvlTranslate (U17.19), D (R108D.2 U5D.16)
MBDACdataAB0: Connector (J3.5), LvlTranslate (U15.44), FMCLPCConnector (P1.D23)
MBDACdataAB1: Connector (J3.7), LvlTranslate (U15.41), FMCLPCConnector (P1.G21)
MBDACdataAB2: Connector (J3.9), LvlTranslate (U15.38), FMCLPCConnector (P1.H22)
MBDACdataAB3: Connector (J3.11), LvlTranslate (U15.36), FMCLPCConnector (P1.G24)
MBDACdataAB4: Connector (J3.13), LvlTranslate (U15.33), FMCLPCConnector (P1.H25)
MBDACdataAB5: Connector (J3.15), LvlTranslate (U15.30), FMCLPCConnector (P1.G28)
MBDACdataAB6: Connector (J3.17), LvlTranslate (U15.27), FMCLPCConnector (P1.H29)
MBDACdataAB7: Connector (J3.18), LvlTranslate (U15.26), FMCLPCConnector (P1.H28)
MBDACdataAB8: Connector (J3.16), LvlTranslate (U15.29), FMCLPCConnector (P1.G27)
MBDACdataAB9: Connector (J3.14), LvlTranslate (U15.32), FMCLPCConnector (P1.H26)
MBDACdataAB10: Connector (J3.12), LvlTranslate (U15.35), FMCLPCConnector (P1.G25)
MBDACdataAB11: Connector (J3.10), LvlTranslate (U15.37), FMCLPCConnector (P1.H23)
MBDACdataAB12: Connector (J3.8), LvlTranslate (U15.40), FMCLPCConnector (P1.G22)
MBDACdataAB13: Connector (J3.6), LvlTranslate (U15.43), FMCLPCConnector (P1.D24)
MBDACdataAB14: Connector (J3.4), LvlTranslate (U15.46), FMCLPCConnector (P1.C23)
MBDACdataAB15: Connector (J3.3), LvlTranslate (U15.47), FMCLPCConnector (P1.C22)
MBDACdataCD0: Connector (J1.62), LvlTranslate (U16.29), FMCLPCConnector (P1.D12)
MBDACdataCD1: Connector (J1.60), LvlTranslate (U16.32), FMCLPCConnector (P1.C10)
MBDACdataCD2: Connector (J1.58), LvlTranslate (U16.35), FMCLPCConnector (P1.H14)
MBDACdataCD3: Connector (J1.56), LvlTranslate (U16.37), FMCLPCConnector (P1.G13)
MBDACdataCD4: Connector (J1.54), LvlTranslate (U16.40), FMCLPCConnector (P1.H7)
MBDACdataCD5: Connector (J1.50), LvlTranslate (U16.43), FMCLPCConnector (P1.G9)
MBDACdataCD6: Connector (J1.48), LvlTranslate (U16.46), FMCLPCConnector (P1.H10)
MBDACdataCD7: Connector (J1.47), LvlTranslate (U16.47), FMCLPCConnector (P1.H11)
MBDACdataCD8: Connector (J1.49), LvlTranslate (U16.44), FMCLPCConnector (P1.G10)
MBDACdataCD9: Connector (J1.53), LvlTranslate (U16.41), FMCLPCConnector (P1.H8)
MBDACdataCD10: Connector (J1.55), LvlTranslate (U16.38), FMCLPCConnector (P1.G12)
MBDACdataCD11: Connector (J1.57), LvlTranslate (U16.36), FMCLPCConnector (P1.H13)
MBDACdataCD12: Connector (J1.59), LvlTranslate (U16.33), FMCLPCConnector (P1.C11)
MBDACdataCD13: Connector (J1.61), LvlTranslate (U16.30), FMCLPCConnector (P1.D11)
MBDACdataCD14: Connector (J1.63), LvlTranslate (U16.27), FMCLPCConnector (P1.D14)
MBDACdataCD15: Connector (J1.64), LvlTranslate (U16.26), FMCLPCConnector (P1.D15)
MBFastDacClkA: Connector (J3.51), LvlTranslate (U17.47), FMCLPCConnector (P1.D20)
MBFastDacClkB: Connector (J3.52), LvlTranslate (U17.46), FMCLPCConnector (P1.D21)
MBFastDacClkC: Connector (J1.51), LvlTranslate (U17.32), FMCLPCConnector (P1.G6)
MBFastDacClkD: Connector (J1.52), LvlTranslate (U17.30), FMCLPCConnector (P1.G7)
MBPowerEnable: Connector (J1.36), LvlTranslate (U17.33), FMCLPCConnector (P1.H31)
MBSPI_CLK: Connector (J1.28), LvlTranslate (U17.43), FMCLPCConnector (P1.H37)
MBSPI_CurrentA_CS: Connector (J1.32), LvlTranslate (U17.38), FMCLPCConnector (P1.H34)
MBSPI_CurrentB_CS: Connector (J1.30), LvlTranslate (U17.41), FMCLPCConnector (P1.G36)
MBSPI_CurrentC_CS: Connector (J1.34), LvlTranslate (U17.36), FMCLPCConnector (P1.G33)
MBSPI_CurrentD_CS: Connector (J1.35), LvlTranslate (U17.35), FMCLPCConnector (P1.H32)
MBSPI_MISO: Connector (J1.29), LvlTranslate (R101.1 U21.4), FMCLPCConnector (P1.G37)
MBSPI_MOSI: Connector (J1.27), LvlTranslate (U17.44), FMCLPCConnector (P1.H38)
MBSPI_OffsetA_CS: Connector (J1.31), LvlTranslate (U17.40), FMCLPCConnector (P1.H35)
MBSPI_OffsetD_CS: Connector (J1.33), LvlTranslate (U17.37)
MBTempSense_CS: Connector (J1.37), LvlTranslate (U17.29), FMCLPCConnector (P1.G31)
PowerEnable: Power (R33.1), LvlTranslate (U17.16)
RefVolt: AF (R105AF.2), B (8 pins)
RefVolt: DF (R105DF.2), C (8 pins)
SPI_CLK: A (R89A.1), LvlTranslate (U17.6 U22.4), AF (U9AF.6), DF (U9DF.6), B (R89B.1), C (R89C.1), D (R89D.1)
SPI_Current_CS: A (R91A.1), LvlTranslate (U17.11)
SPI_Current_CS: LvlTranslate (U17.8), B (R91B.1)
SPI_Current_CS: LvlTranslate (U17.13), C (R91C.1)
SPI_Current_CS: LvlTranslate (U17.14), D (R91D.1)
SPI_MOSI: A (R87A.1), LvlTranslate (U17.5 U22.2), AF (U9AF.7), DF (U9DF.7), B (R87B.1), C (R87C.1), D (R87D.1)
SPI_Offset_CS: LvlTranslate (U17.9), AF (U9AF.5)
SPI_Offset_CS: LvlTranslate (U17.12), DF (U9DF.5)